# Altium schematic sheet connectors.SchDoc
size A4
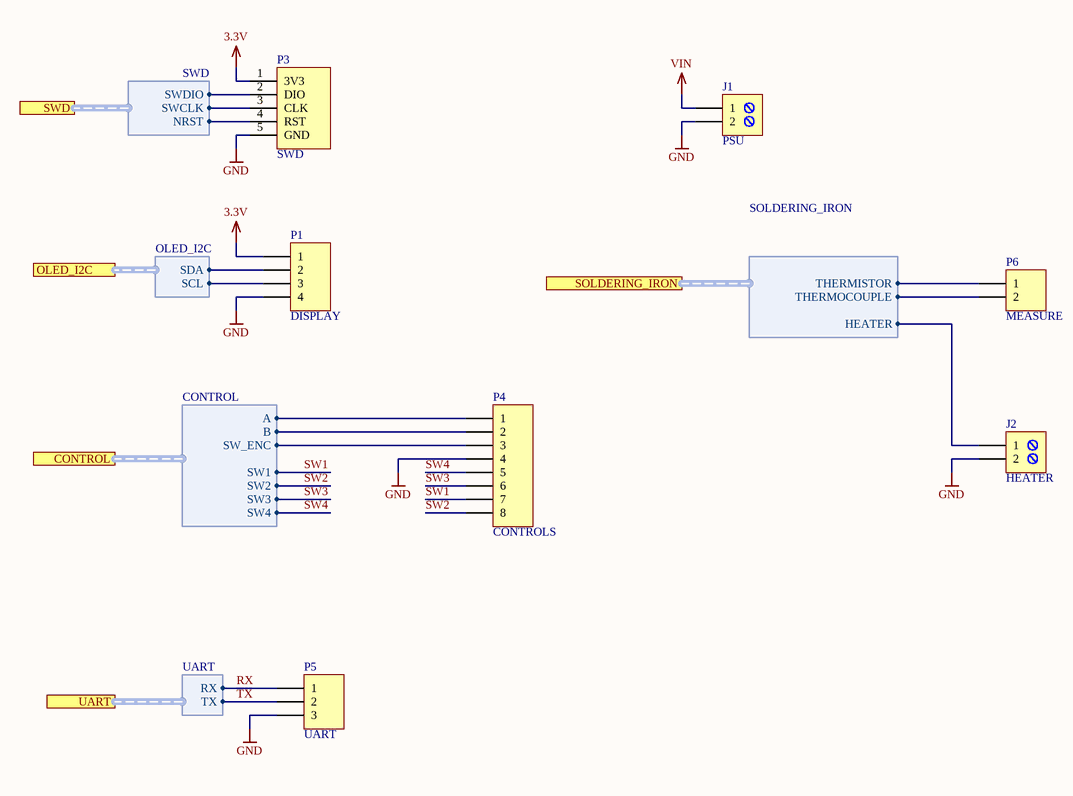
[diagram p0: connectors.SchDoc]

## Parts
J1  PSU  [J_ARK2]
J2  HEATER  [J_ARK2]
P1  DISPLAY  [P_HEADER_1x4_2.54]
P3  SWD  [SWD_Header]
P4  CONTROLS  [P_HEADER_1x8_2.54]
P5  UART  [P_HEADER_1x3_2.54]
P6  MEASURE  [P_HEADER_1x2_2.54]

## Ports
CONTROL (harness CONTROL), OLED_I2C (harness OLED_I2C), SOLDERING_IRON (harness SOLDERING_IRON), SWD (harness SWD), UART (harness UART)

## Harnesses
OLED_I2C: SDA, SCL
SWD: NRST, SWCLK, SWDIO
CONTROL: A, B, SW_ENC, SW1, SW2, SW3, SW4
UART: RX, TX
SOLDERING_IRON: HEATER, THERMISTOR, THERMOCOUPLE

## Nets
3.3V: P1.1 P3.1(3V3)
GND: J1.2 J2.2 P1.4 P3.5(GND) P4.4 P5.3
VIN: J1.1
RX: P5.1 ; port UART.RX
SW1: P4.7 ; port CONTROL.SW1
SW2: P4.8 ; port CONTROL.SW2
SW3: P4.6 ; port CONTROL.SW3
SW4: P4.5 ; port CONTROL.SW4
TX: P5.2 ; port UART.TX
NetJ2_1: J2.1 ; port SOLDERING_IRON.HEATER
NetP1_2: P1.2 ; port OLED_I2C.SDA
NetP1_3: P1.3 ; port OLED_I2C.SCL
NetP3_2: P3.2(DIO) ; port SWD.SWDIO
NetP3_3: P3.3(CLK) ; port SWD.SWCLK
NetP3_4: P3.4(RST) ; port SWD.NRST
NetP4_1: P4.1 ; port CONTROL.A
NetP4_2: P4.2 ; port CONTROL.B
NetP4_3: P4.3 ; port CONTROL.SW_ENC
NetP6_1: P6.1 ; port SOLDERING_IRON.THERMISTOR
NetP6_2: P6.2 ; port SOLDERING_IRON.THERMOCOUPLE

## Library data of the parts
J1 J2 = J_TB-5.0-P-2P: ARK Screw terminal, 2-Pin; Manufacturer: DEGSON ELECTRONICS; Value: DG301-5.0-02P-12-18A(H); SCH_Footprint: ARK2; Part Number: J_TB-5.0-P-2P; Component Type: Standard; HelpURL: https://datasheet.octopart.com/DG301-5.0-03P-12-18A%28H%29-Degson-datasheet-17801202.pdf; Manufacturer Part Number: DG301-5.0-02P-12-18A(H); Supplier 1: TME; Supplier Part Number 1: DG301-5.0-2/6B; Supplier 2: RS Components; Supplier 3: Farnell; Supplier 4: Mouser; Supplier 5: Digi-Key
P1 = P_HEADER_1x4_2.54: Header, 4-Pin; Manufacturer: Connfly; Value: DS1021-1*4SF1-1; SCH_Footprint: 1x4 2.54mm; Part Number: P_HEADER_1x4_2.54; Component Type: Standard; HelpURL: http://datasheet.octopart.com/DS1021-1%2A4SF1-1-Connfly-datasheet-65537859.pdf; Manufacturer Part Number: DS1021-1*4SF1-1; Supplier 1: TME; Supplier Part Number 1: ZL201-04G; Supplier 2: RS Components; Supplier 3: Farnell; Supplier 4: Mouser; Supplier 5: Digi-Key
P3 = SWD_Header: 1x5 2.54 SWD Header
P4 = P_HEADER_1x8_2.54: Header, 8-Pin; Manufacturer: Connfly; Value: DS1021-1*8SF1-1; SCH_Footprint: 1x8 2.54mm; Part Number: P_HEADER_1x8_2.54; Component Type: Standard; HelpURL: http://www.tme.eu/en/Document/cc301e58a5da78cb543a94b5a5b7f06a/DS1021.pdf; Manufacturer Part Number: DS1021-1*8SF1-1; Supplier 1: TME; Supplier Part Number 1: ZL201-08G; Supplier 2: RS Components; Supplier 3: Farnell; Supplier 4: Mouser; Supplier 5: Digi-Key
P5 = P_HEADER_1x3_2.54: Header, 3-Pin; Manufacturer: Connfly; Value: DS1021-1*3SF1-1; SCH_Footprint: 1x3 2.54mm; Part Number: P_HEADER_1x3_2.54; Component Type: Standard; HelpURL: http://www.tme.eu/en/Document/cc301e58a5da78cb543a94b5a5b7f06a/DS1021.pdf; Manufacturer Part Number: DS1021-1*3SF1-1; Supplier 1: TME; Supplier Part Number 1: ZL201-03G; Supplier 2: RS Components; Supplier 3: Farnell; Supplier 4: Mouser; Supplier 5: Digi-Key
P6 = P_HEADER_1x2_2.54: Header, 2-Pin; Manufacturer: Connfly; Value: DS1021-1*2SF1-1; SCH_Footprint: 1x2 2.54mm; Part Number: P_HEADER_1x2_2.54; Component Type: Standard; HelpURL: http://www.tme.eu/en/Document/cc301e58a5da78cb543a94b5a5b7f06a/DS1021.pdf; Manufacturer Part Number: DS1021-1*2SF1-1; Supplier 1: TME; Supplier Part Number 1: ZL201-02G; Supplier 2: RS Components; Supplier 3: Farnell; Supplier 4: Mouser; Supplier 5: Digi-Key